# EAGLE schematic button (EAGLE 6.5.0)
AUTHOR: Neal Jackson; REV: A; TITLE: BMO Button Plate
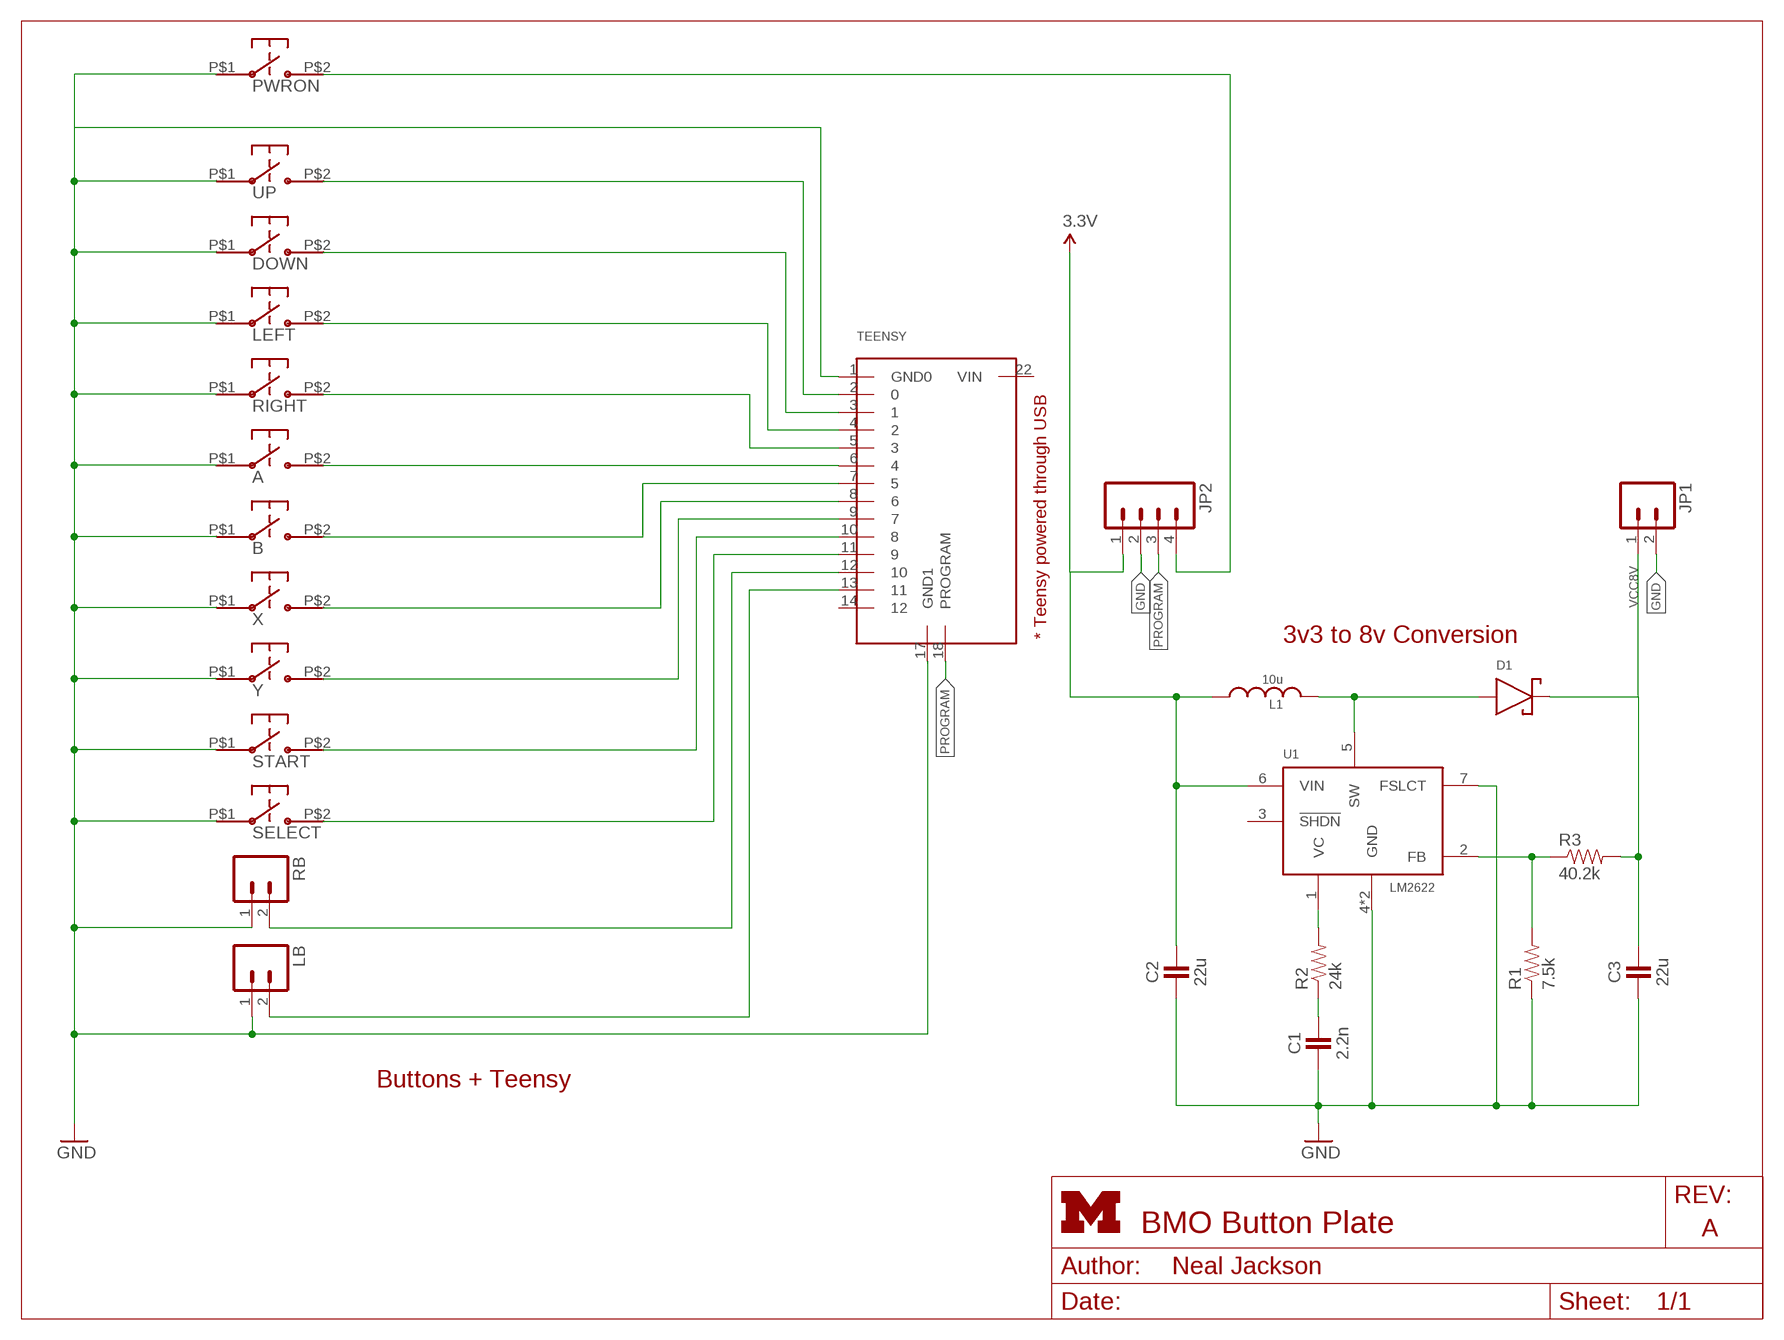
[diagram p0: schematic, sheet 1]
FRAME1 (LETTER_L): HEIGHT: 8.5in; WIDTH: 11in

## Parts
A  SKPDAMD010  [SKPDAMD010]
B  SKPDAMD010  [SKPDAMD010]
C1  2.2n  CAPACITOR  [0402_CAP]
C2  22u  CAPACITOR  [0402_CAP]
C3  22u  CAPACITOR  [0402_CAP]
D1  MBRM140T3G  [DO-216AA]
DOWN  SKPDAMD010  [SKPDAMD010]
JP1  M02PTH  [1X02]
JP2  M04PTH  [1X04]
L1  10u  INDUCTOR0402  [0402_CAP]
LB  M02PTH  [1X02]
LEFT  SKPDAMD010  [SKPDAMD010]
PWRON  SKPDAMD010  [SKPDAMD010]
R1  7.5k  RESISTOR0402_RES  [0402_RES]
R2  24k  RESISTOR0402_RES  [0402_RES]
R3  40.2k  RESISTOR0402_RES  [0402_RES]
RB  M02PTH  [1X02]
RIGHT  SKPDAMD010  [SKPDAMD010]
SELECT  EVQ11D09K  [EVQ11D09K]
START  EVQ11D09K  [EVQ11D09K]
TEENSY  TEENSY_LC  [TEENSY_LC]
U1  LM2622  [MSOP8]
UP  SKPDAMD010  [SKPDAMD010]
X  SKPDAMD010  [SKPDAMD010]
Y  SKPDAMD010  [SKPDAMD010]

## Nets
3.3V: C2.1 JP2.1 L1.1 U1.6(VIN)
GND: A.P$1 B.P$1 C1.2 C2.2 C3.2 DOWN.P$1 JP1.2 JP2.2 LB.1 LEFT.P$1 PWRON.P$1 R1.1 RB.1 RIGHT.P$1 SELECT.P$1 START.P$1 TEENSY.1(GND0) TEENSY.17(GND1) U1.4(GND) U1.7(FSLCT) U1.GND UP.P$1 X.P$1 Y.P$1
N$1: A.P$2 TEENSY.6
N$2: JP2.4 PWRON.P$2
N$3: TEENSY.2 UP.P$2
N$4: DOWN.P$2 TEENSY.3
N$5: LEFT.P$2 TEENSY.4
N$6: RIGHT.P$2 TEENSY.5
N$7: C1.1 R2.1
N$8: B.P$2 TEENSY.7
N$9: TEENSY.8 X.P$2
N$10: TEENSY.9 Y.P$2
N$11: START.P$2 TEENSY.10
N$12: SELECT.P$2 TEENSY.11
N$13: RB.2 TEENSY.12
N$14: LB.2 TEENSY.13
N$15: R2.2 U1.1(VC)
N$16: D1.ANODE L1.2 U1.5(SW)
N$17: R1.2 R3.1 U1.2(FB)
PROGRAM: JP2.3 TEENSY.18(PROGRAM)
VCC8V: C3.1 D1.CATHODE JP1.1 R3.2
Unconnected: TEENSY.14 TEENSY.22(VIN) U1.3(!SHDN)

## Notes on the sheet
- * Teensy powered through USB
- 3v3 to 8v Conversion
- Buttons + Teensy

## Library data of the parts
A B DOWN LEFT PWRON RIGHT UP X Y = switches:SKPDAMD010; MOUSER: 688-SKPDAM
C1-C3 = passives:CAPACITOR: 0402 Capacitor
D1 = BMO:MBRM140T3G
JP1 LB RB = SparkFun-Connectors:M02: Header 2 Standard 2-pin 0.1" header. Use with straight break away headers (SKU : PRT-00116), right angle break away headers (PRT-00553), swiss pins (PRT-00743), machine pins (PRT-00117), and female headers (PRT-00115). Molex polarized connector foot print use with SKU : PRT-08233 with associated crimp pins and housings.
JP2 = SparkFun-Connectors:M04: Header 4 Standard 4-pin 0.1" header. Use with straight break away headers (SKU : PRT-00116), right angle break away headers (PRT-00553), swiss pins (PRT-00743), machine pins (PRT-00117), and female headers (PRT-00115). Molex polarized connector foot print use with SKU : PRT-08231 with associated crimp pins and housings. 1MM SMD Version SKU: PRT-10208
L1 = passives:INDUCTOR
R1-R3 = passives:RESISTOR: Resistor Basic schematic elements and footprints for 0603, 1206, and PTH resistors.
SELECT START = BMO:EVQ11D09K
TEENSY = BMO:TEENSY_LC
U1 = BMO:LM2622